# EAGLE design CAN-D Rev2 (EAGLE 9.3.2)
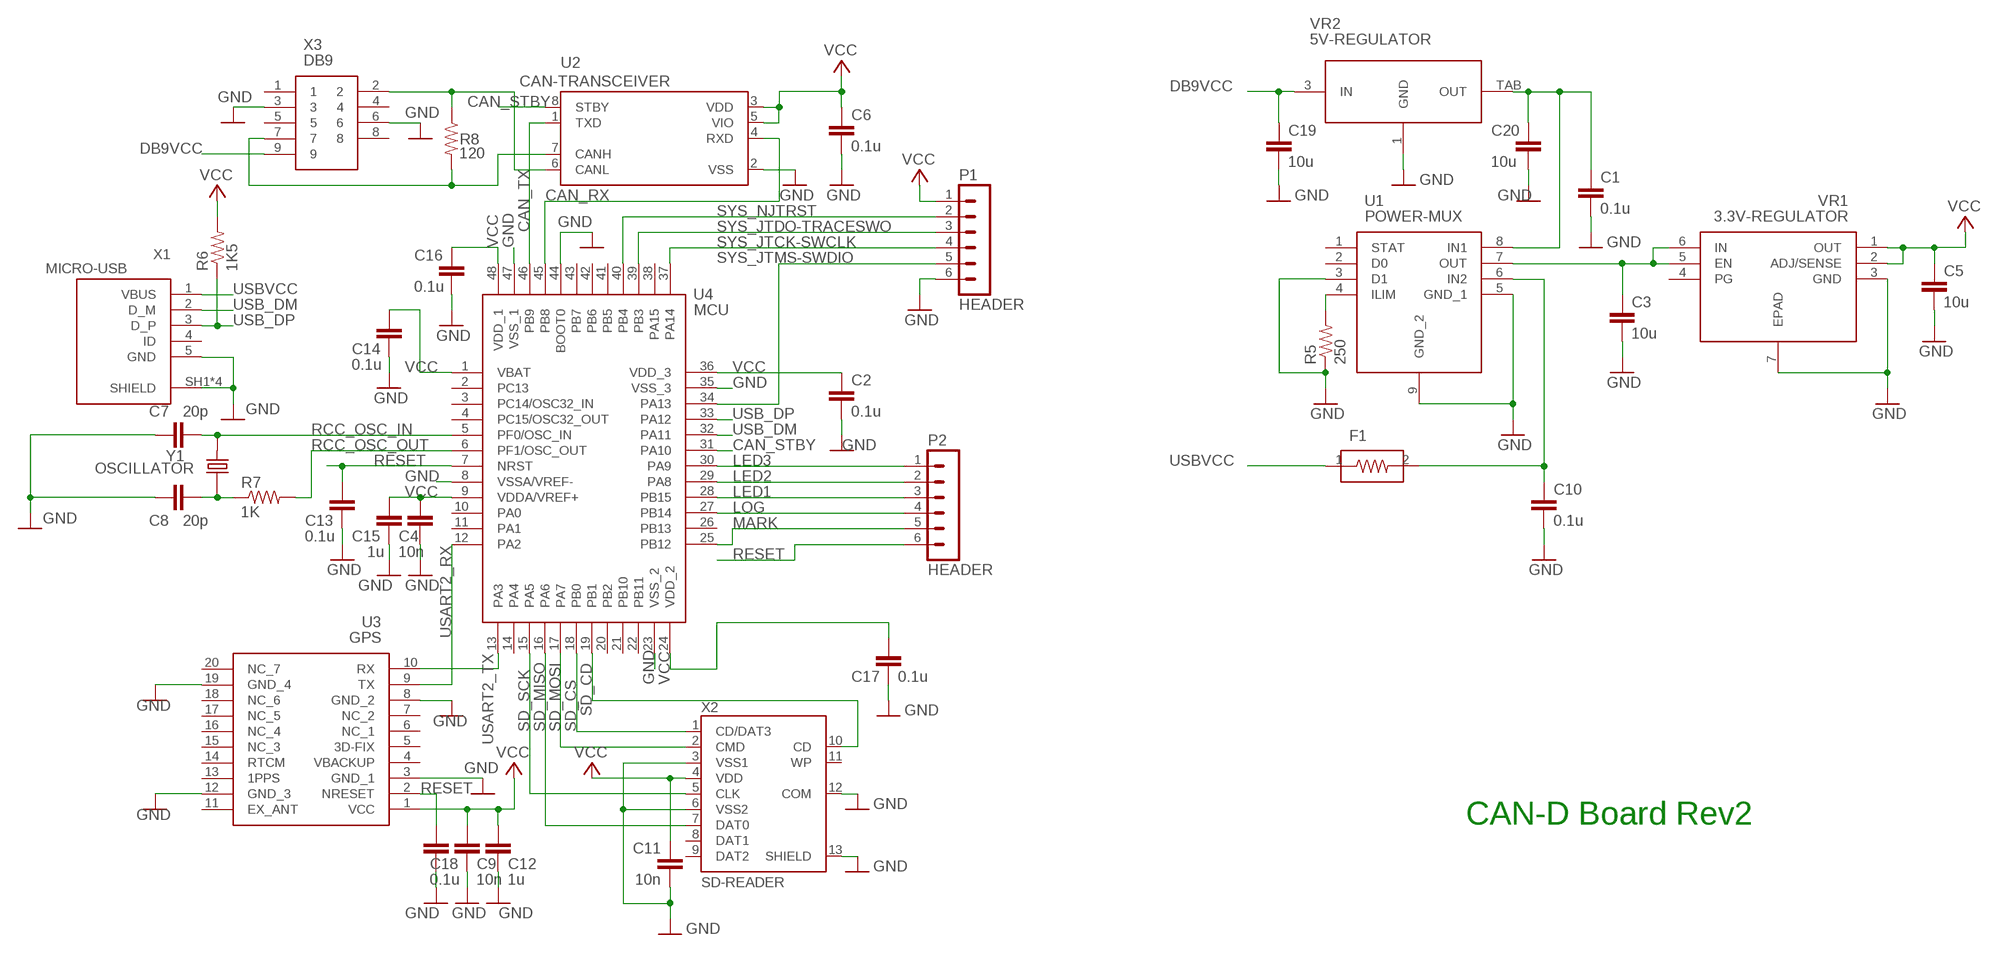
[diagram p0: schematic, sheet 1]

## Parts
C1  0.1u  C-EUC0603  [C0603]
C2  0.1u  C-EUC0603  [C0603]
C3  10u  C-EUC0603  [C0603]
C4  10n  C-EUC0603  [C0603]
C5  10u  C-EUC0603  [C0603]
C6  0.1u  C-EUC0603  [C0603]
C7  20p  C-EUC0603  [C0603]
C8  20p  C-EUC0603  [C0603]
C9  10n  C-EUC0603  [C0603]
C10  0.1u  C-EUC0603  [C0603]
C11  10n  C-EUC0603  [C0603]
C12  1u  C-EUC0603  [C0603]
C13  0.1u  C-EUC0603  [C0603]
C14  0.1u  C-EUC0603  [C0603]
C15  1u  C-EUC0603  [C0603]
C16  0.1u  C-EUC0603  [C0603]
C17  0.1u  C-EUC0603  [C0603]
C18  0.1u  C-EUC0603  [C0603]
C19  10u  C-EUC0603  [C0603]
C20  10u  C-EUC0603  [C0603]
F1  FUSE  [0ZCJ0025FF2E]
P1  HEADER  [TSM-106-02-L-SV-P-TR]
P2  HEADER  [TSM-106-02-L-SV-P-TR]
R5  250  R-US_R0603  [R0603]
R6  1K5  R-US_R0603  [R0603]
R7  1K  R-US_R0603  [R0603]
R8  120  R-US_R0603  [R0603]
U1  POWER-MUX  [TPS2115ADRBR]
U2  CAN-TRANSCEIVER  [MCP2562-E/SN]
U3  GPS  [FGPMMOPA6H]
U4  MCU  [STM32F302CCT6]
VR1  3.3V-REGULATOR  [LD39200PU33R]
VR2  5V-REGULATOR  [LD1086D2T50TR]
X1  MICRO-USB  [DX4R005HJ5R2000]
X2  SD-READER  [DM1AA-SF-PEJ(21)]
X3  DB9  [1-1740195-2]
Y1  OSCILLATOR  [ABLS-8.000MHZ-B2-T]

## Nets
CAN_RX: U2.4(RXD) U4.45(PB8)
CAN_STBY: U2.8(STBY) U4.31(PA10)
CAN_TX: U2.1(TXD) U4.46(PB9)
DB9VCC: C19.1 VR2.3(IN) X3.9
GND: C1.2 C2.2 C3.2 C4.2 C5.2 C6.2 C7.2 C8.2 C9.2 C10.2 C11.2 C12.2 C13.2 C14.2 C15.2 C16.2 C17.2 C18.2 C19.2 C20.2 P1.6 R5.1 U1.3(D1) U1.5(GND_1) U1.9(GND_2) U2.2(VSS) U3.3(GND_1) U3.8(GND_2) U3.12(GND_3) U3.19(GND_4) U4.8(VSSA/VREF-) U4.23(VSS_2) U4.35(VSS_3) U4.44(BOOT0) U4.47(VSS_1) VR1.3(GND) VR1.7(EPAD) VR2.1(GND) X1.5(GND) X1.SH1(SHIELD) X1.SH2(SHIELD) X1.SH3(SHIELD) X1.SH4(SHIELD) X2.3(VSS1) X2.6(VSS2) X2.12(COM) X2.13(SHIELD) X3.3 X3.6
LED1: P2.3 U4.28(PB15)
LED2: P2.2 U4.29(PA8)
LED3: P2.1 U4.30(PA9)
LOG: P2.4 U4.27(PB14)
MARK: P2.5 U4.25(PB12)
N$1: C3.1 U1.7(OUT) VR1.5(EN) VR1.6(IN)
N$2: R8.2 U2.7(CANH) X3.7
N$3: C1.1 C20.1 U1.8(IN1) VR2.TAB(OUT)
N$7: R8.1 U2.6(CANL) X3.2
N$8: R5.2 U1.4(ILIM)
N$9: C10.1 F1.2 U1.6(IN2)
N$10: C8.1 R7.1 Y1.1
RCC_OSC_IN: C7.1 U4.5(PF0/OSC_IN) Y1.2
RCC_OSC_OUT: R7.2 U4.6(PF1/OSC_OUT)
RESET: C13.1 C18.1 P2.6 U3.2(NRESET) U4.7(NRST)
SD_CD: U4.19(PB1) X2.10(CD)
SD_CS: U4.18(PB0) X2.1(CD/DAT3)
SD_MISO: U4.16(PA6) X2.7(DAT0)
SD_MOSI: U4.17(PA7) X2.2(CMD)
SD_SCK: U4.15(PA5) X2.5(CLK)
SYS_JTCK-SWCLK: P1.4 U4.37(PA14)
SYS_JTDO-TRACESWO: P1.3 U4.39(PB3)
SYS_JTMS-SWDIO: P1.5 U4.34(PA13)
SYS_NJTRST: P1.2 U4.40(PB4)
USART2_RX: U3.9(TX) U4.12(PA2)
USART2_TX: U3.10(RX) U4.13(PA3)
USB_DM: U4.32(PA11) X1.2(D_M)
USB_DP: R6.1 U4.33(PA12) X1.3(D_P)
USBVCC: F1.1 X1.1(VBUS)
VCC: C2.1 C4.1 C5.1 C6.1 C9.1 C11.1 C12.1 C14.1 C15.1 C16.1 C17.1 P1.1 R6.2 U2.3(VDD) U2.5(VIO) U3.1(VCC) U4.1(VBAT) U4.9(VDDA/VREF+) U4.24(VDD_2) U4.36(VDD_3) U4.48(VDD_1) VR1.1(OUT) VR1.2(ADJ/SENSE) X2.4(VDD)
Unconnected: U1.1(STAT) U1.2(D0) U3.4(VBACKUP) U3.5(3D-FIX) U3.6(NC_1) U3.7(NC_2) U3.11(EX_ANT) U3.13(1PPS) U3.14(RTCM) U3.15(NC_3) U3.16(NC_4) U3.17(NC_5) U3.18(NC_6) U3.20(NC_7) U4.2(PC13) U4.3(PC14/OSC32_IN) U4.4(PC15/OSC32_OUT) U4.10(PA0) U4.11(PA1) U4.14(PA4) U4.20(PB2) U4.21(PB10) U4.22(PB11) U4.26(PB13) U4.38(PA15) U4.41(PB5) U4.42(PB6) U4.43(PB7) VR1.4(PG) X1.4(ID) X2.8(DAT1) X2.9(DAT2) X2.11(WP) X3.1 X3.4 X3.5 X3.8

## Notes on the sheet
- CAN-D Board Rev2

## Library data of the parts
C1-C20 = rcl:C-EU: CAPACITOR, European symbol; SPICEPREFIX: C
F1 = CAN-D:FUSE: PTC Resettable Fuse 0.25A(hold) 0.5A(trip) 16VDC 100A 0.6W 0.08s 0.55Ohm SMD Solder Pad 3.5 X 1.8 X 0.75mm T/R; DESCRIPTION: PTC Resettable Fuse 0.25A_hold_ 0.5A_trip_ 16VDC 100A 0.6W 0.08s 0.55Ohm SMD Solder Pad 3.5 X 1.8 X 0.75mm T/R; DIGI-KEY_PART_NUMBER: 507-1798-1-ND; DIGI-KEY_PURCHASE_URL: https://www.digikey.ca/product-detail/en/bel-fuse-inc/0ZCJ0025FF2E/507-1798-1-ND/4156230?utm_source=snapeda&utm_medium=aggregator&utm_campaign=symbol; MF: Bel Fuse; MP: 0ZCJ0025FF2E; PACKAGE: 1206 Bel Fuse
P1 P2 = CAN-D:HEADER: SMD PIN HEADER
R5-R8 = rcl:R-US_: RESISTOR, American symbol; SPICEPREFIX: R
U1 = CAN-D:POWER-MUX: Autoswitching Power Mux Source: Datasheet <http://www.ti.com/lit/gpn/tps2115a>; DESCRIPTION: Autoswitching Power Mux; HEIGHT: 1mm; MANUFACTURER_NAME: Texas Instruments; MANUFACTURER_PART_NUMBER: TPS2115ADRBR; MOUSER_PART_NUMBER: 595-TPS2115ADRBR; MOUSER_PRICE-STOCK: https://www.mouser.com/Search/Refine.aspx?Keyword=595-TPS2115ADRBR
U2 = CAN-D:CAN-TRANSCEIVER: MCP2562 Series 5 V Surface Mount High-Speed CAN Transceiver - SOIC-8; AVAILABILITY: Unavailable; DESCRIPTION: Microchip MCP2562-E/SN, CAN Transceiver 1MBps 1-channel IEC 61000-4-2, 8-Pin SOIC; MF: Microchip; MP: MCP2562-E/SN; PACKAGE: SO-8 Microchip; PRICE: None
U3 = CAN-D:GPS: GPS Standalone Module, 20-pin Source: Datasheet <https://cdn-shop.adafruit.com/datasheets/GlobalTop-FGPMMOPA6H-Datasheet-V0A.pdf>; DESCRIPTION: GPS Standalone Module, 20-pin; HEIGHT: mm; MANUFACTURER_NAME: GlobalTop Technology Inc.; MANUFACTURER_PART_NUMBER: FGPMMOPA6H
U4 = CAN-D:MCU: STM32F302CCT6 Source: Datasheet <http://www.st.com/web/en/resource/technical/document/datasheet/DM00094064.pdf>; ALLIED_NUMBER: 70520771; ALLIED_PRICE-STOCK: http://www.alliedelec.com/stmicroelectronics-stm32f302cct6/70520771/; HEIGHT: 1.6mm; MANUFACTURER_NAME: STMicroelectronics; MANUFACTURER_PART_NUMBER: STM32F302CCT6; MOUSER_PART_NUMBER: 511-STM32F302CCT6; MOUSER_PRICE-STOCK: https://www.mouser.com/Search/Refine.aspx?Keyword=511-STM32F302CCT6; RS_PART_NUMBER: 1656736; RS_PRICE-STOCK: http://uk.rs-online.com/web/p/products/1656736
VR1 = CAN-D:3.3V-REGULATOR: LDO Voltage Regulators 2 A high PSRR ultra low drop linear regulator with reverse current protection Source: Datasheet <https://www.st.com/resource/en/datasheet/ld39200.pdf>; DESCRIPTION: LDO Voltage Regulators 2 A high PSRR ultra low drop linear regulator with reverse current protection; HEIGHT: 1mm; MANUFACTURER_NAME: STMicroelectronics; MANUFACTURER_PART_NUMBER: LD39200PU33R; MOUSER_PART_NUMBER: 511-LD39200PU33R; MOUSER_PRICE-STOCK: https://www.mouser.com/Search/Refine.aspx?Keyword=511-LD39200PU33R
VR2 = CAN-D:5V-REGULATOR; DESCRIPTION: Linear Voltage Regulator IC Positive Fixed 1 Output 1.5A D2PAK; DIGI-KEY_PART_NUMBER: 497-1225-1-ND; DIGI-KEY_PURCHASE_URL: https://www.digikey.com/product-detail/en/stmicroelectronics/LD1086D2T50TR/497-1225-1-ND/586225; MF: STMicroelectronics; MP: LD1086D2T50TR; PACKAGE: D2PAK STMicroelectronics
X1 = CAN-D:MICRO-USB: RCPT MICRO USB 2.0 B SMT H/D; DESCRIPTION: DX4 series, receptacle, on-board, right-angle standard mount, surface mount; DIGI-KEY_PART_NUMBER: 670-2674-1-ND; DIGI-KEY_PURCHASE_URL: https://www.digikey.ca/product-detail/en/jae-electronics/DX4R005HJ5R2000/670-2674-1-ND/3903234?utm_source=snapeda&utm_medium=aggregator&utm_campaign=symbol; MF: JAE Electronics; MP: DX4R005HJ5R2000; PACKAGE: None
X2 = CAN-D:SD-READER: DM1 Series 12 (9+3) Position 2.90 mm Pitch SMT Right Angle PC Card Connector; DESCRIPTION: DM1 Series 12 _9+3_ Position 2.90 mm Pitch SMT Right Angle PC Card Connector; DIGI-KEY_PART_NUMBER: HR845CT-ND; DIGI-KEY_PURCHASE_URL: https://www.digikey.ca/product-detail/en/hirose-electric-co-ltd/DM1AA-SF-PEJ_21_/HR845CT-ND/559985?utm_source=snapeda&utm_medium=aggregator&utm_campaign=symbol; MF: Hirose; MP: DM1AA-SF-PEJ_21_; PACKAGE: None
X3 = CAN-D:DB9: 9 pos smt plug 4-40 threaded/inserts Source: Datasheet <http://www.te.com/commerce/DocumentDelivery/DDEController?Action=showdoc&DocId=Customer Drawing1740195EpdfEnglishENG_CD_1740195_E.pdf1-1740195-2>; ALLIED_NUMBER: 70287697; ALLIED_PRICE-STOCK: http://www.alliedelec.com/te-connectivity-1-1740195-2/70287697/; DESCRIPTION: 9 pos smt plug 4-40 threaded/inserts; HEIGHT: mm; MANUFACTURER_NAME: TE Connectivity; MANUFACTURER_PART_NUMBER: 1-1740195-2; MOUSER_PART_NUMBER: 571-1-1740195-2; MOUSER_PRICE-STOCK: https://www.mouser.com/Search/Refine.aspx?Keyword=571-1-1740195-2; RS_PART_NUMBER: 5269513P; RS_PRICE-STOCK: http://uk.rs-online.com/web/p/products/5269513P
Y1 = CAN-D:OSCILLATOR: Crystal 8MHz Â±20ppm (Tol) Â±50ppm (Stability) 18pF FUND 80Ohm 2-Pin HC-49/US SMD T/R; AVAILABILITY: Unavailable; DESCRIPTION: Crystal 8MHz Â±20ppm _Tol_ Â±50ppm _Stability_ 18pF FUND 80Ohm 2-Pin HC-49/US SMD T/R; MF: Abracon LLC; MP: ABLS-8.000MHZ-B2-T; PACKAGE: HC49/US Abracon; PRICE: None

## Board
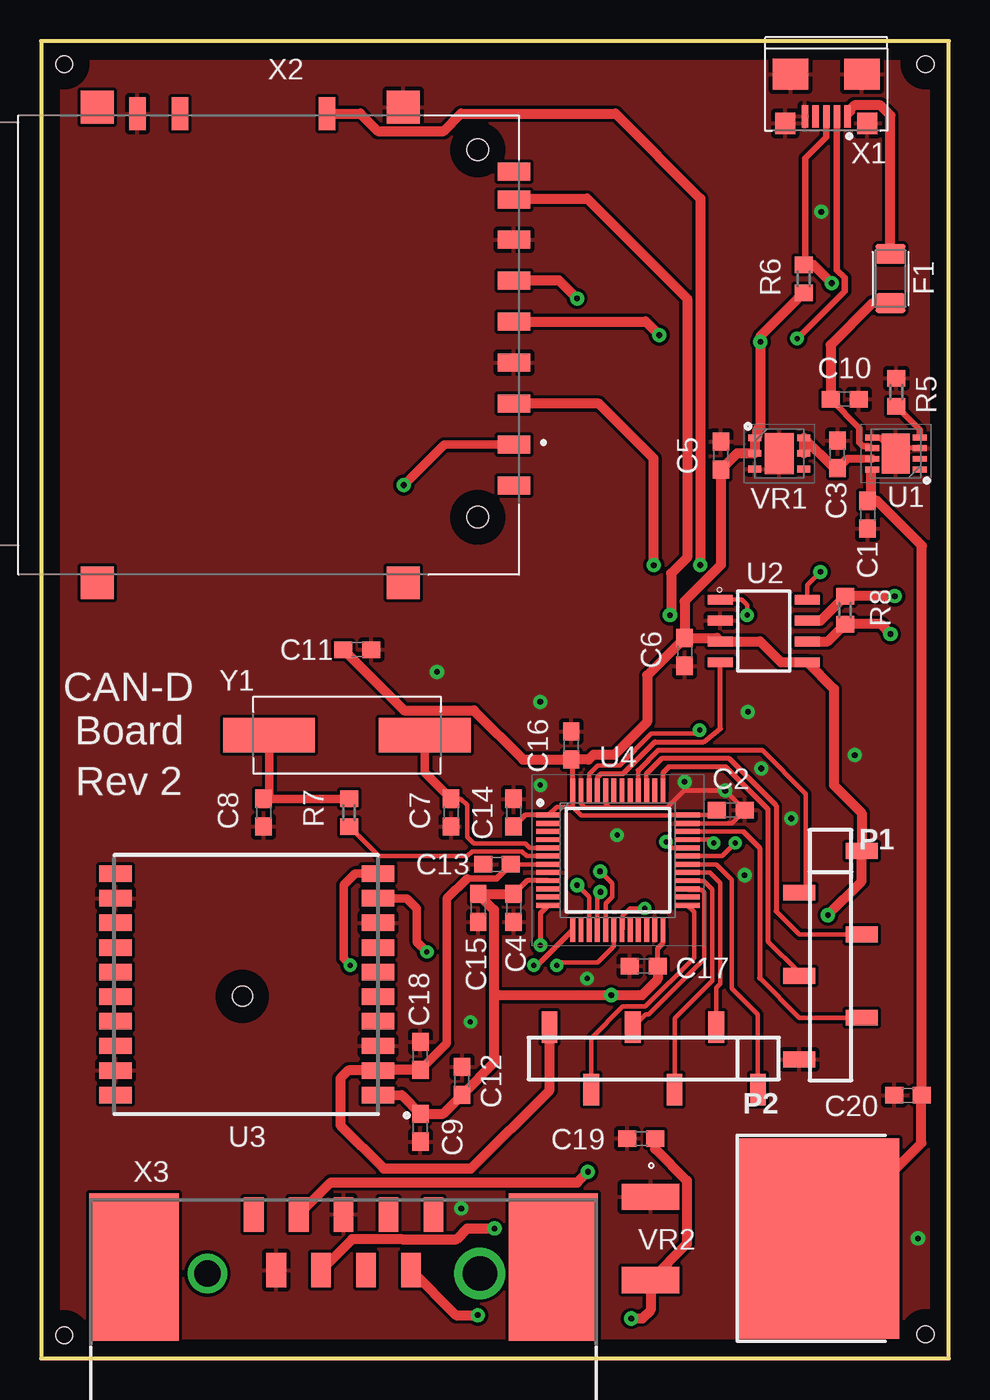
[diagram p1: board, top side]
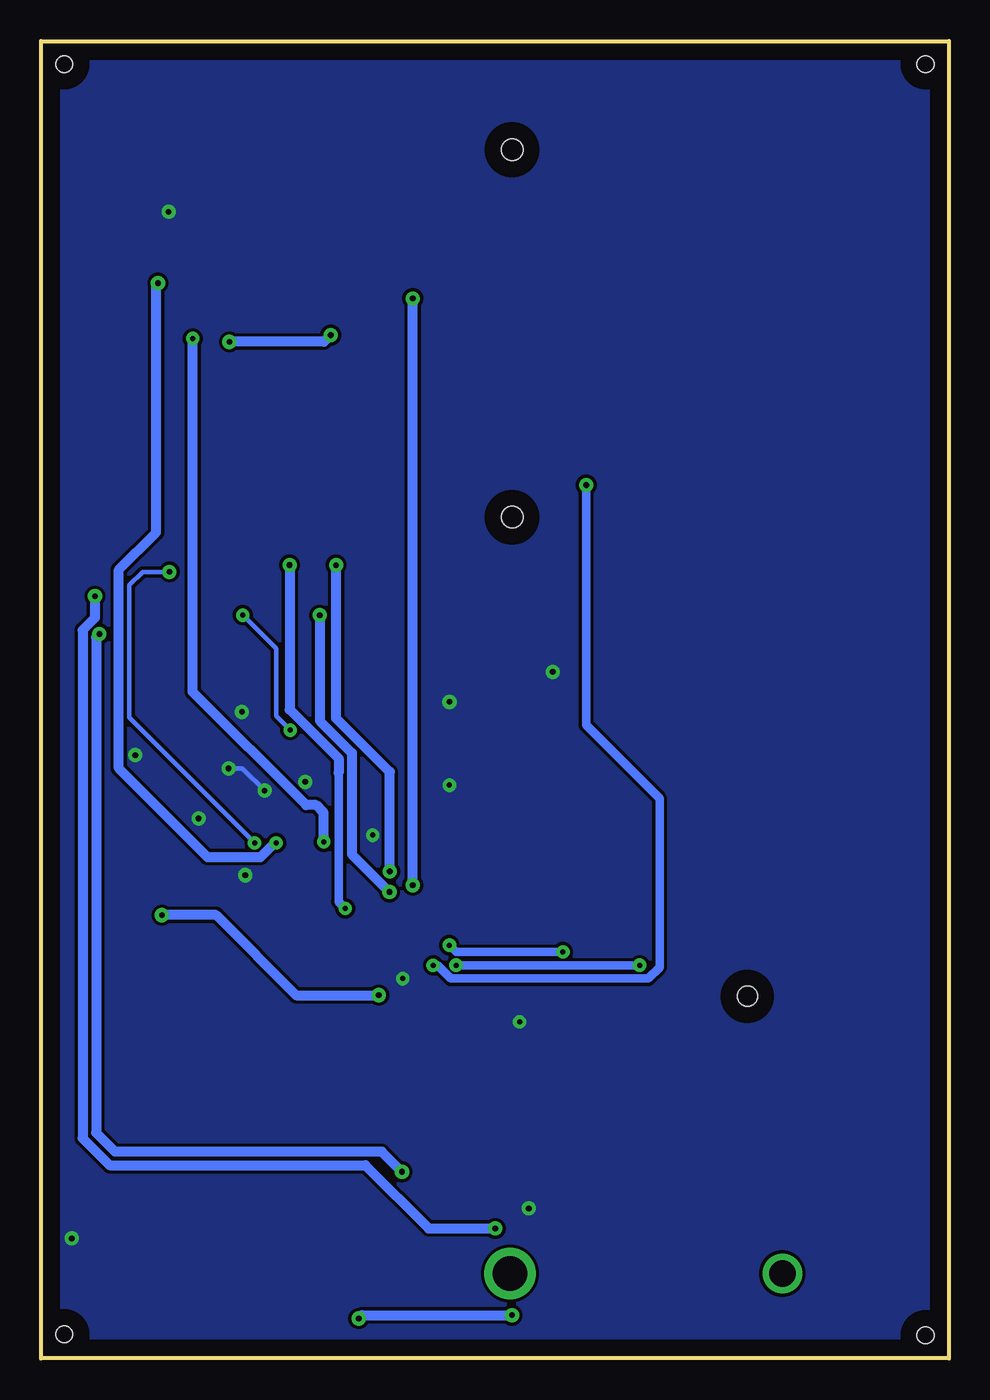
[diagram p2: board, bottom side, seen from below]

Size 55.32 x 80.31 mm. Coordinates in mm from the lower left corner, seen from the top.
Outline: 0,0 55.32,0 55.32,80.31 0,80.31 0,0
Copper layers (1*16): Top 0.035mm / dielectric 1.5mm / Bottom 0.035mm
Design rules "mine": minimum track width 11mil, minimum drill 0.3mm, track to track 8mil, track to pad 6mil, pad to pad 6mil, via to via 6mil, smd to smd 6mil, copper to edge 40mil, drill to drill 6mil, minimum pad ring 12mil, minimum via ring 10mil, stop-mask expansion 4mil, vias tented up to drill 15mil, thermal gap 10mil
Holes 1 mm at 1.42,1.42 53.9,78.89 1.42,78.89 53.9,1.47

### Footprints (pad centres in the part's own frame; a part is rotated, then mirrored left to right if it is on the bottom)
C0603 = smd 1.1 x 1: 1 -0.85,0; 2 0.85,0
0ZCJ0025FF2E = smd 1.2 x 1.82: 1 -1.505,0; 2 1.505,0
TSM-106-02-L-SV-P-TR = smd 0.965 x 1.93: 1 6.35,-1.905; 2 3.81,1.905; 3 1.27,-1.905; 4 -1.27,1.905; 5 -3.81,-1.905; 6 -6.35,1.905
R0603 = smd 1 x 1.1: 1 -0.85,0; 2 0.85,0
TPS2115ADRBR = smd 0.85 x 0.35: 1 -1.45,0.975; 2 -1.45,0.325; 3 -1.45,-0.325; 4 -1.45,-0.975; 5 1.45,-0.975; 6 1.45,-0.325; 7 1.45,0.325; 8 1.45,0.975 | smd 1.7 x 2.45: 9 0,0
MCP2562-E/SN = smd 1.5 x 0.6: 1 -2.65,1.905; 2 -2.65,0.635; 3 -2.65,-0.635; 4 -2.65,-1.905; 5 2.65,-1.905; 6 2.65,-0.635; 7 2.65,0.635; 8 2.65,1.905
FGPMMOPA6H = smd 2 x 1: 1 -16.07,-1.172; 2 -16.07,-2.672; 3 -16.07,-4.172; 4 -16.07,-5.672; 5 -16.07,-7.172; 6 -16.07,-8.672; 7 -16.07,-10.172; 8 -16.07,-11.672; 9 -16.07,-13.172; 10 -16.07,-14.672; 11 -0.07,-14.672; 12 -0.07,-13.172; 13 -0.07,-11.672; 14 -0.07,-10.172; 15 -0.07,-8.672; 16 -0.07,-7.172; 17 -0.07,-5.672; 18 -0.07,-4.172; 19 -0.07,-2.672; 20 -0.07,-1.172 | hole 1.2: -7.8,-7.2
STM32F302CCT6 = smd 1.475 x 0.3: 1 -4.238,2.75; 2 -4.238,2.25; 3 -4.238,1.75; 4 -4.238,1.25; 5 -4.238,0.75; 6 -4.238,0.25; 7 -4.238,-0.25; 8 -4.238,-0.75; 9 -4.238,-1.25; 10 -4.238,-1.75; 11 -4.238,-2.25; 12 -4.238,-2.75; 25 4.238,-2.75; 26 4.238,-2.25; 27 4.238,-1.75; 28 4.238,-1.25; 29 4.238,-0.75; 30 4.238,-0.25; 31 4.238,0.25; 32 4.238,0.75; 33 4.238,1.25; 34 4.238,1.75; 35 4.238,2.25; 36 4.238,2.75 | smd 0.3 x 1.475: 13 -2.75,-4.238; 14 -2.25,-4.238; 15 -1.75,-4.238; 16 -1.25,-4.238; 17 -0.75,-4.238; 18 -0.25,-4.238; 19 0.25,-4.238; 20 0.75,-4.238; 21 1.25,-4.238; 22 1.75,-4.238; 23 2.25,-4.238; 24 2.75,-4.238; 37 2.75,4.238; 38 2.25,4.238; 39 1.75,4.238; 40 1.25,4.238; 41 0.75,4.238; 42 0.25,4.238; 43 -0.25,4.238; 44 -0.75,4.238; 45 -1.25,4.238; 46 -1.75,4.238; 47 -2.25,4.238; 48 -2.75,4.238
LD39200PU33R = smd 0.8 x 0.4: 1 -1.5,0.95; 2 -1.5,0; 3 -1.5,-0.95; 4 1.5,-0.95; 5 1.5,0; 6 1.5,0.95 | smd 1.75 x 2.5: 7 0,0
LD1086D2T50TR = smd 3.5 x 1.6: 1 -4.1,2.54; 3 -4.1,-2.54 | smd 9.75 x 12.2: TAB 6.175,0
DX4R005HJ5R2000 = smd 0.4 x 1.35: 1 -1.3,0; 2 -0.65,0; 3 0,0; 4 0.65,0; 5 1.3,0 | smd 1.2 x 1.3: SH1 -2.5,0.425; SH2 2.5,0.425 | smd 2.15 x 1.9: SH3 -2.175,-2.575; SH4 2.175,-2.575
DM1AA-SF-PEJ(21) = smd 1.1 x 2: 1 6.875,14.95; 2 4.375,14.95; 3 1.875,14.95; 4 -0.625,14.95; 5 -3.125,14.95; 6 -5.625,14.95; 7 -8.05,14.95; 8 -9.75,14.95; 9 9.375,14.95 | smd 2 x 1: 10 -13.3,3.55; 11 -13.3,-5.4; 12 -13.3,-8 | smd 2 x 2: 13 -13.7,8.2; 14 -13.7,-10.45; 15 15.3,-10.45; 16 15.3,8.2 | hole 1.3: -11.1,12.75; 11.3,12.75
1-1740195-2 = smd 1.2 x 2.1: 1 5.48,-16.5; 2 2.74,-16.5; 3 0,-16.5; 4 -2.74,-16.5; 5 -5.48,-16.5; 6 4.11,-13.1; 7 1.37,-13.1; 8 -1.37,-13.1; 9 -4.11,-13.1 | smd 5.45 x 9: 10 -12.775,-13.3; 11 12.775,-13.3 | drill 2.1 pad 3: 12 -8.3,-12.9 | drill 1.6 pad 2.35: 13 8.3,-12.9
ABLS-8.000MHZ-B2-T = smd 5.6 x 2.1: 1 -4.75,0; 2 4.75,0

### Placement (x,y rotation side)
C1  50.37,51.44 270 top
C2  42.04,33.43 0 top
C3  48.54,55.12 90 top
C4  28.8,27.46 270 top
C5  41.43,55.04 90 top
C6  39.22,43.08 270 top
C7  24.99,33.27 270 top
C8  13.56,33.27 270 top
C9  23.11,14.07 270 top
C10  48.97,58.47 0 top
C11  19.28,43.2 0 top
C12  25.65,16.92 90 top
C13  27.79,30.12 180 top
C14  28.8,33.27 90 top
C15  26.64,27.46 270 top
C16  32.31,37.36 90 top
C17  36.73,23.93 180 top
C18  23.11,18.44 90 top
C19  36.58,13.41 180 top
C20  52.83,16.05 180 top
F1  51.77,65.84 270 top
P1  48.11,24.59 90 top
P2  37.34,18.29 0 top
R5  52.12,58.9 270 top
R6  46.48,65.81 270 top
R7  18.77,33.27 270 top
R8  49,45.62 90 top
U1  52.09,55.17 180 top
U2  44.04,44.35 0 top
U3  4.47,14.88 180 top
U4  35.15,30.38 0 top
VR1  44.98,55.17 0 top
VR2  41.25,7.32 0 top
X1  47.85,75.72 180 top
X2  13.87,62.59 270 top
X3  18.44,-7.72 180 top
Y1  18.64,38 0 top

### Tracks (layer width: path | path; a pad name or v marks a point on that pad's centre or on a via)
CAN_RX
  Top 0.279: U4.45 33.9,35.44 33.95,35.48
  Top 0.305: 33.95,35.48 34.13,35.66 35.47,35.66 37.41,37.59 40.39,37.59 41.4,38.41 U2.4
CAN_STBY  (via drill 0.3, 0.35)
  Top 0.279: U4.31 41.5,30.63 v42.3,31.43 | U2.8 46.69,47.15 v47.5,47.95
  Bottom 0.279: v47.5,47.95 49.12,47.95 49.94,47.14 49.94,39.06 v42.3,31.43
CAN_TX  (via drill 0.3)
  Top 0.279: U4.46 33.41,35.64 33.92,36.15 35.27,36.15 37.2,38.09 39.92,38.09 v40.14,38.3 | v43.03,45.31 43.03,45.92 42.7,46.25 U2.1
  Bottom 0.279: v40.14,38.3 41,39.16 41,43.28 v43.03,45.31
DB9VCC  (via drill 0.35)
  Top 0.61: v35.97,2.44 36.64,2.44 37.15,2.95 VR2.3 39.36,6.98 39.36,10.85 37.43,12.78 C19.1 | X3.9 25.29,2.64 v26.62,2.64
  Bottom 0.61: v35.97,2.44 35.76,2.64 v26.62,2.64
GND  (via drill 0.3, 0.35)
  Top 0.279: U4.35 42.09,32.63 C2.2 v41.7,34.62 39.2,34.62 38.17,33.59 34.63,33.59 | 34.63,33.59 33.13,33.59 32.92,33.8 32.92,34.6 U4.47 | U4.44 34.4,33.82 34.63,33.59
  Top 0.305: U1.5 51.12,56.14 U1.9 52.42,55.49 U1.3
  Bottom 0.279: v41.7,34.62 43.05,35.97 v43.89,35.97
  other vias: 30.43,34.95 33.27,23.16 26.16,20.52 30.43,40.03 35.1,31.9 24.13,41.86 43.08,39.42 39.22,35.15 49.58,36.78 42.88,29.46 53.44,7.32 47.55,69.9 25.6,9.14 45.72,32.92
  pour Top: -1.27,-1.68 57.25,-1.68 57.25,81.74 -1.27,81.74
  pour Bottom: -1.42,81.73 57.35,81.92 57.35,-1.83 -1.42,-1.83
LED1
  Top 0.279: P2.3 38.61,20.73 40.9,23.02 40.9,28.6 40.39,29.11 39.41,29.11 U4.28
LED2
  Top 0.279: U4.29 40.76,29.63 41.39,29 41.39,22.82 41.15,22.58 P2.2
LED3
  Top 0.279: U4.30 41.14,30.13 42.1,29.17 42.1,22.55 43.69,20.97 P2.1
LOG
  Top 0.279: U4.27 39.45,28.57 40.25,28.57 40.42,28.4 40.42,24.36 37.03,20.97 36.84,20.97 P2.4
MARK
  Top 0.279: P2.5 33.53,19.51 35.46,21.45 36.83,21.45 39.8,24.42 39.8,27.22 U4.25
N$1
  Top 0.508: U1.7 49.12,54.84 C3.1
  Top 0.61: C3.1 48.33,54.27 VR1.6 VR1.5
N$2  (via drill 0.35)
  Top 0.61: U2.7 47.51,44.98 R8.2 v52.03,46.47 | v27.64,7.92 25.97,7.92 25.32,7.27 21.97,7.27 18.96,7.27 X3.7
  Bottom 0.61: v52.03,46.47 52.03,45.15 52.78,44.4 52.78,13.43 51.14,11.79 35.56,11.79 31.7,7.92 v27.64,7.92
N$3
  Top 0.305: U1.8 50.6,54.15 50.6,54.05
  Top 0.61: 50.6,54.05 50.6,52.51 C1.1 50.94,52.28 53.68,49.54 C20.1 53.65,16.02 53.65,13.13 47.83,7.32 VR2.TAB
N$7  (via drill 0.35)
  Top 0.61: U2.6 47.94,43.71 R8.1 51.16,44.77 v51.77,44.16 | v33.33,11.38 32.68,10.74 17.66,10.74 X3.2
  Bottom 0.61: v33.33,11.38 34.54,12.6 50.8,12.6 51.97,13.77 51.97,43.96 v51.77,44.16
N$8
  Top 0.406: R5.2 53.55,56.63 U1.4
N$9
  Top 0.305: U1.6 50.53,55.61 50.39,55.61
  Top 0.406: C10.1 49.87,56.73 49.87,55.82 50.07,55.61 50.39,55.61
  Top 0.61: F1.2 50.67,64.33 48.12,61.79 C10.1
N$10
  Top 0.508: R7.1 C8.1 13.89,34.45 Y1.1
RCC_OSC_IN
  Top 0.279: U4.5 29.78,31.13 29.51,31.4 26.36,31.4 25.96,31.8 25.96,33.73 25.57,34.12 C7.1
  Top 0.508: Y1.2 23.39,35.72 C7.1
RCC_OSC_OUT
  Top 0.279: R7.2 20.57,30.63 25.98,30.63 26.27,30.92 29.31,30.92 29.6,30.63 U4.6
RESET
  Top 0.279: U4.7 C13.1
  Top 0.406: 25.96,29.26 27.77,29.26 C13.1
  Top 0.508: C18.1 24.74,19.22 24.74,28.04 25.96,29.26
  Top 0.61: C18.1 20.57,17.59 U3.2 18.73,17.56 18.24,17.07 18.24,14.22 20.88,11.58 26.21,11.58 30.99,16.36 P2.6
SD_CD  (via drill 0.3, 0.35)
  Top 0.279: U4.19 35.46,26.2 35.46,27 35.9,27.44 v36.79,27.44
  Top 0.61: X2.10 19.47,75.89 20.52,74.83 24.53,74.83 25.59,75.89 35.01,75.89 40.18,70.71 40.18,48.38 v40.17,48.37
  Bottom 0.508: 37.19,35.71 37.19,27.84 v36.79,27.44
  Bottom 0.61: 37.19,35.71 37.19,36.58 40.17,39.56 v40.17,48.37
SD_CS  (via drill 0.3, 0.35)
  Top 0.279: U4.18 34.9,25.12 33.93,24.15 31.62,24.15 v31.43,23.96
  Top 0.508: v22.1,53.24 24.57,55.71 X2.1
  Bottom 0.508: v31.43,23.96 31.15,23.96 30.36,23.16 18.31,23.16 17.63,23.84 17.63,34.14 22.1,38.61 v22.1,53.24
SD_MISO  (via drill 0.35)
  Top 0.279: U4.16 33.9,28.27 v34.09,28.45
  Top 0.61: X2.7 28.9,70.71 33.27,70.71 39.37,64.62 39.37,48.82 38.41,47.86 38.41,45.39 v38.33,45.31
  Bottom 0.61: v38.33,45.31 38.33,38.87 36.38,36.92 36.38,30.74 v34.09,28.45
SD_MOSI  (via drill 0.35)
  Top 0.279: U4.17 34.4,27.75 34.81,28.15 34.81,28.95 v34.07,29.68
  Top 0.61: v37.34,48.36 37.34,54.86 33.99,58.21 X2.2
  Bottom 0.61: v34.07,29.68 34.07,35.76 37.34,39.02 v37.34,48.36
SD_SCK  (via drill 0.35)
  Top 0.279: U4.15 33.4,28.11 33.37,28.15 v32.66,28.85
  Top 0.61: v32.66,64.62 31.57,65.71 X2.5
  Bottom 0.61: v32.66,28.85 v32.66,64.62
SYS_JTCK-SWCLK
  Top 0.279: 44.3,25.43 46.2,23.53 P1.4
  Top 0.305: U4.37 37.9,35.72 38.25,36.07 41.73,36.07 44.3,33.5 44.3,25.43
SYS_JTDO-TRACESWO
  Top 0.279: U4.39 36.89,34.63 36.89,35.64 | 44.8,27.26 46.2,25.86 P1.3
  Top 0.305: 36.89,35.64 37.83,36.58 41.94,36.58 44.8,33.71 44.8,27.26
SYS_JTMS-SWDIO
  Top 0.279: 43.79,23.19 46.2,20.78 P1.5 | U4.34 39.4,32.12 40.7,32.12 40.71,32.13 42.59,32.13 42.6,32.12 42.8,32.12
  Top 0.305: 43.79,23.19 43.79,31.13 42.8,32.12
SYS_NJTRST
  Top 0.279: U4.40 36.4,35.42 36.39,35.43 36.39,35.84 36.38,35.85 | 43.94,37.08 46.61,34.42 46.61,28.8 P1.2
  Top 0.305: 36.38,35.85 37.62,37.08 43.94,37.08
USART2_RX  (via drill 0.3)
  Top 0.305: U4.12 30.43,27.14 v30.43,25.2
  Top 0.508: v23.52,24.79 22.91,25.4 22.91,27.43 22.29,28.06 U3.9
  Bottom 0.508: v30.43,25.2 30.02,24.79 v23.52,24.79
USART2_TX  (via drill 0.3)
  Top 0.305: U4.13 30.24,23.98 v30.02,23.98
  Top 0.508: v18.85,23.98 18.44,24.38 18.44,28.85 19.14,29.56 U3.10
  Bottom 0.508: v30.02,23.98 v18.85,23.98
USB_DM  (via drill 0.3)
  Top 0.279: U4.32 38.46,31.13 v38.09,31.5
  Top 0.406: X1.2 48.5,66.35 48.98,65.87 48.98,65.08 v46.08,62.18
  Bottom 0.61: v38.09,31.5 38.09,33.27 38.56,33.73 39.17,33.73 46.08,40.64 v46.08,62.18
USB_DP  (via drill 0.3, 0.35)
  Top 0.279: U4.33 40.8,31.63 v41,31.43
  Top 0.406: X1.3 47.85,74.45 46.58,73.18 46.58,66.76 R6.1
  Top 0.61: v48.19,65.55 47.08,66.66 R6.1
  Bottom 0.61: v41,31.43 41.08,31.43 41.95,30.57 45.18,30.57 50.58,35.97 50.58,48.09 48.31,50.36 48.31,65.43 v48.19,65.55
USBVCC
  Top 0.406: X1.1 49.4,75.96 49.4,76.23 49.45,76.28
  Top 0.61: 49.45,76.28 49.56,76.4 51.14,76.4 51.77,75.78 F1.1
VCC  (via drill 0.35)
  Top 0.279: U4.24 37.9,25.32 37.86,25.28 | C2.1 40.89,33.13 U4.36 38.4,33.13 38.37,33.1 32.93,33.1 32.4,33.63 | U4.48 32.4,33.63 | U4.1 31.42,33.63 32.4,33.63
  Top 0.305: U4.9 29.62,29.13 C4.1 | 37.86,25.28 37.58,25 C17.1 | U4.1 29.51,33.13 C14.1 | U4.48 32.4,36.42 C16.1
  Top 0.61: R6.2 43.84,62.32 v43.84,61.98 43.84,56.8 43.65,56.61 43.65,56.29 VR1.1 VR1.2 42.4,55.17 C5.1 41.43,48.37 39.22,46.16 C6.1 | C6.1 41.18,43.93 U2.3 43.81,43.71 45.09,42.44 U2.5 48.31,40.83 48.31,34.95 50.01,33.25 P1.1 50.01,29.08 v47.95,27.03 | U3.1 21.98,16.06 C9.1 24.51,14.92 C12.1 27.6,18.01 27.6,22.15 | C4.1 C15.1 27.6,27.35 27.6,22.15 | C11.1 22.13,39.51 26.38,39.51 29.38,36.51 C16.1 33.37,36.51 33.65,36.8 34.92,36.8 36.93,38.81 36.93,41.64 C6.1 | C17.1 37.58,23.11 36.61,22.15 v34.75,22.15 27.6,22.15 | X2.4 36.84,63.21 v37.67,62.38
  Bottom 0.61: v37.67,62.38 38.08,61.98 v43.84,61.98 | v47.95,27.03 44.65,27.03 39.78,22.15 v34.75,22.15

### Text on the board
tPlace: CAN-D / Board | Rev 2